# Altium schematic sheet GPS_IMU.SchDoc: BACH
size A; SheetNumber: 3; SheetTotal: 4
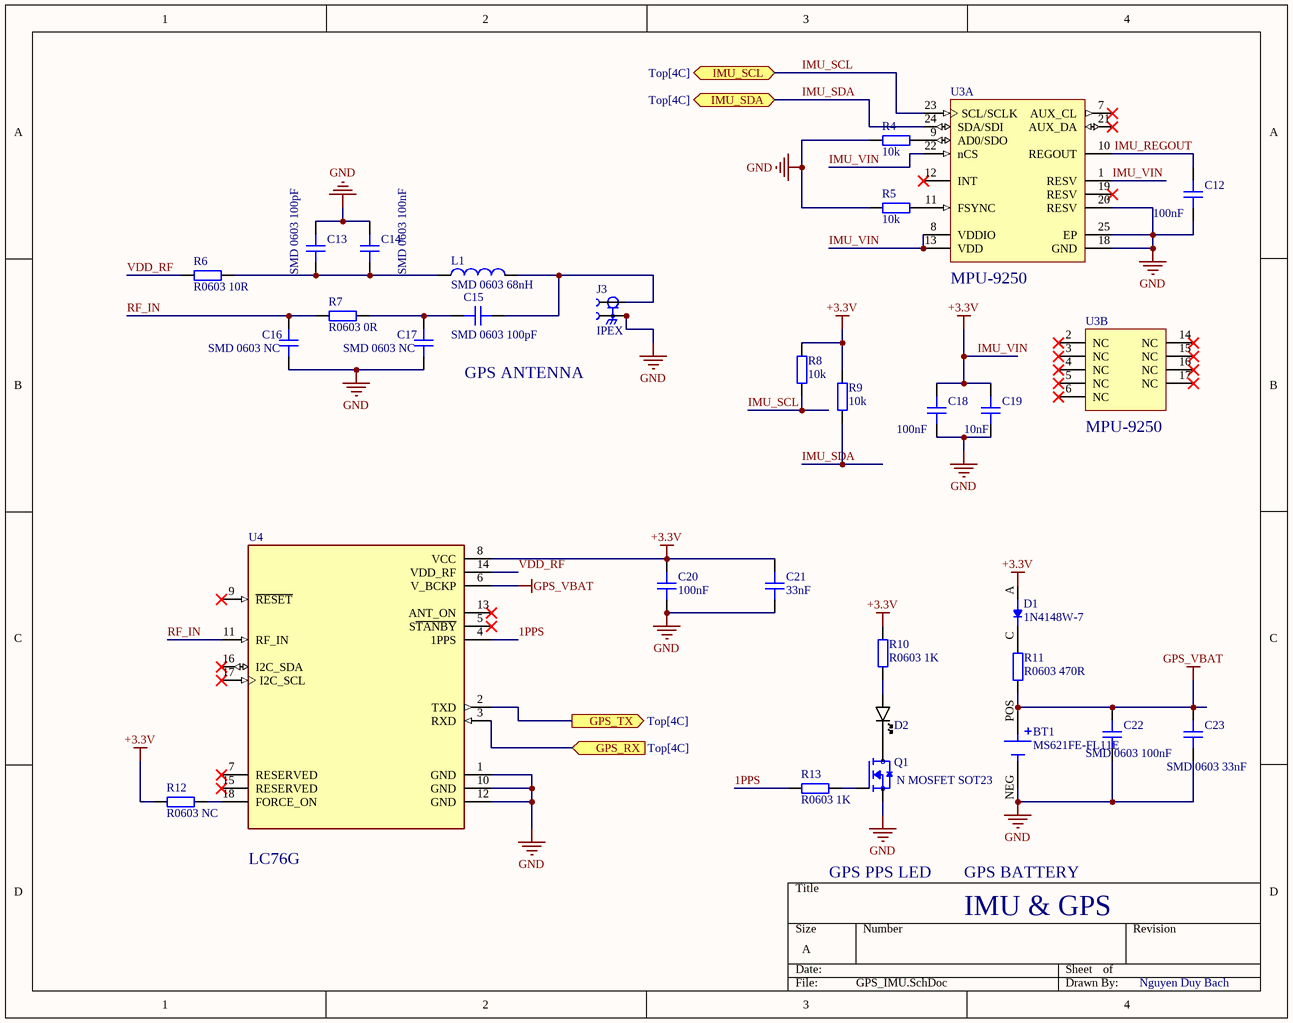
[diagram p0: GPS_IMU.SchDoc]

## Parts
BT1  MS621FE-FL11E  [BAT_MS621FE-FL11E]
C12  100nF  [CAP_0603]
C13  SMD 0603 100pF  [CAP_0603]
C14  SMD 0603 100nF  [CAP_0603]
C15  SMD 0603 100pF  [CAP_0603]
C16  SMD 0603 NC  [NC_0603]
C17  SMD 0603 NC  [NC_0603]
C18  100nF  [CAP_0603]
C19  10nF  [CAP_0603]
C20  100nF  [CAP_0603]
C21  33nF  [CAP_0603]
C22  SMD 0603 100nF  [CAP_0603]
C23  SMD 0603 33nF  [CAP_0603]
D1  1N4148W-7  [SOD3715X135N]
D2  BLUE  [LED_0805]  (value not drawn)
J3  IPEX  [IPEX_20279-001E-03]
L1  SMD 0603 68nH  [0603 INDUCTOR]
Q1  N MOSFET SOT23  [SOT95P237X112-3N]
R4  10k  [RES_0603]
R5  10k  [RES_0603]
R6  R0603 10R  [RES_0603]
R7  R0603 0R  [RES_0603]
R8  10k  [RES_0603]
R9  10k  [RES_0603]
R10  R0603 1K  [RES_0603]
R11  R0603 470R  [RES_0603]
R12  R0603 NC  [NC_0603]
R13  R0603 1K  [RES_0603]
U3  MPU-9250  [INSE-QFN-24-1700X1540TP_M]  (parts A,B of 2)
U4  LC76G  [XCVR_LC76G]

## Ports
GPS_RX (in, see Top[4C]), GPS_TX (out, see Top[4C]), IMU_SCL (bidir, see Top[4C]), IMU_SDA (bidir, see Top[4C])

## Nets
GND: BT1.NEG C12.1 C13.2 C14.2 C16.2 C17.2 C18.1 C19.1 C20.1 C21.1 C22.1 C23.1 J3.2(GROUND) J3.3(GROUND) Q1.2(S) R4.2 R5.2 U3.18(GND) U3.20(RESV) U3.25(EP) U4.1(GND) U4.10(GND) U4.12(GND)
GPS_VBAT: BT1.POS C22.2 C23.2 R11.1 U4.6(V_BCKP)
IMU_VIN: C18.2 C19.2 C20.2 C21.2 D1.A R8.2 R9.2 R10.2 R12.1 U3.1(RESV) U3.8(VDDIO) U3.13(VDD) U3.22(nCS) U4.8(VCC)  [also labelled +3.3V]
1PPS: R13.2 U4.4(1PPS)
GPS_RX: U4.3(RXD) ; port GPS_RX
GPS_TX: U4.2(TXD) ; port GPS_TX
IMU_REGOUT: C12.2 U3.10(REGOUT)
IMU_SCL: R8.1 U3.23(SCL/SCLK) ; port IMU_SCL
IMU_SDA: R9.1 U3.24(SDA/SDI) ; port IMU_SDA
RF_IN: C16.1 R7.1 U4.11(RF_IN)
VDD_RF: R6.1 U4.14(VDD_RF)
NetC13_1: C13.1 C14.1 L1.1 R6.2
NetC15_1: C15.1 C17.1 R7.2
NetC15_2: C15.2 J3.1(SIGNAL) L1.2
NetD1_C: D1.C(K) R11.2
NetD2_A: D2.A R10.1
NetD2_K: D2.K Q1.3(D)
NetQ1_1: Q1.1(G) R13.1
NetR4_1: R4.1 U3.9(AD0/SDO)
NetR5_1: R5.1 U3.11(FSYNC)
NetR12_2: R12.2 U4.18(FORCE_ON)

Not connected (* = marked no-connect by the designer): U3 2(NC)* 3(NC)* 4(NC)* 5(NC)* 6(NC)* 7(AUX_CL)* 12(INT)* 14(NC)* 15(NC)* 16(NC)* 17(NC)* 19(RESV)* 21(AUX_DA)*; U4 5(S~{TANBY})* 7(RESERVED)* 9(~{RESET})* 13(ANT_ON)* 15(RESERVED)* 16(I2C_SDA)* 17(I2C_SCL)*

## Notes on the sheet
- GPS ANTENNA
- GPS PPS LED
- GPS BATTERY
- IMU & GPS
- Nguyen Duy Bach

## Library data of the parts
BT1 = MS621FE-FL11E: Coin, 6.8mm 3 V Lithium Battery Rechargeable (Secondary) 5.5mAh; MF: Seiko Instruments; Value: *; Purchase-URL: https://pricing.snapeda.com/search/part/MS621FE-FL11E/?ref=eda; Package: QFP-128 Seiko; Availability: In Stock; Check_prices: https://www.snapeda.com/parts/MS621FE-FL11E/Seiko+Instruments/view-part/?ref=eda; Price: None; SnapEDA_Link: https://www.snapeda.com/parts/MS621FE-FL11E/Seiko+Instruments/view-part/?ref=snap; MP: MS621FE-FL11E
C12-C23 = CAP_0603: Capacitor SMD 0603; Manufacturer: *; Manufacturer Part Number: *; Distributor Link: *; LCSC: *; Rating: *; Dielectric: *
D1 = 1N4148W-7: Diode Standard 100 V 300mA (DC) Surface Mount SOD-123; MF: Diodes Inc.; SnapEDA_Link: https://www.snapeda.com/parts/1N4148W-7/Diodes+Inc./view-part/?ref=snap; Package: SOD-123 Fairchild Semiconductor; MP: 1N4148W-7; Check_prices: https://www.snapeda.com/parts/1N4148W-7/Diodes+Inc./view-part/?ref=eda; Purchase-URL: https://pricing.snapeda.com/search/part/1N4148W-7/?ref=eda; Price: None; Value: *; Availability: In Stock
D2 = LED_0805: LED 0805 BLUE SMD; Manufacturer: *; Manufacturer Part Number: *; Distributor Link: *; LCSC: *
J3 = IPEX: 1 POS Vertical SMD Small form factor with big performance through 6 GHz connector,MHF, RF, micro-coaxial MHF I Receptacle; MF: I-PEX; MP: 20279-001E-03; SnapEDA_Link: https://www.snapeda.com/parts/20279-001E-03/I-PEX/view-part/?ref=snap; Package: None; Value: *; Check_prices: https://www.snapeda.com/parts/20279-001E-03/I-PEX/view-part/?ref=eda
L1 = INDUCTOR_0603: Inductor with 0603 (1608); MP: LQW18AS22NG0CD; MF: Murata; Purchase-URL: https://pricing.snapeda.com/search/part/LQW18AS22NG0CD/?ref=eda; Value: *; Availability: Warning; Package: 1608 Murata; SnapEDA_Link: https://www.snapeda.com/parts/LQW18AS22NG0CD/Murata/view-part/4476690/?ref=snap; Price: None; Check_prices: https://www.snapeda.com/parts/LQW18AS22NG0CD/Murata/view-part/4476690/?ref=eda
Q1 = SI2306BDS-T1-GE3: N-Channel 30 V 3.16A (Ta) 750mW (Ta) Surface Mount SOT-23-3 (TO-236); MF: Vishay Siliconix; SnapEDA_Link: https://www.snapeda.com/parts/SI2306BDS-T1-GE3/Vishay/view-part/?ref=snap; Package: SOT-23-3 Vishay Siliconix; Value: *; MP: SI2306BDS-T1-GE3; Check_prices: https://www.snapeda.com/parts/SI2306BDS-T1-GE3/Vishay/view-part/?ref=eda
R4-R13 = RES_0603: Resistor SMD 0603; Manufacturer: *; Manufacturer Part Number: *; Distributor Link: *; LCSC: *
U3 = CMP-2100-03657-1: 9-axis MotionTracking device, 2.4 to 3,6 V, -40 to 85 degC, 24-Pin QFN, RoHS, Tape and Reel; Manufacturer: InvenSense; Max Supply Voltage: 3.6V; Min Supply Voltage: 2.4V; Package Reference: QFN-24; Package Quantity: 1; Datasheet Version: Rev. 1.0, 01/2014; Case/Package: QFN; Package Description: 24-Pin Quad Flat No-lead Package, Body 3 x 3 mm, Pitch 0.4 mm; Datasheet URL: http://datasheet.octopart.com/MPU-9250-InvenSense-datasheet-21859386.pdf; RoHSCompliant: true; Max Operating Temperature: 85degC; Height: 1mm; Mount: SurfaceMount; Manufacturer URL: http://www.invensense.com/; Width: 3.1mm; Min Operating Temperature: -40degC; Length: 3.1mm
U4 = LC76G: MF: Quectel; Package: None; Price: None; Value: *; MP: LC76G; Availability: Unavailable